# EAGLE schematic DME_Board_1 (EAGLE 7.2.0)
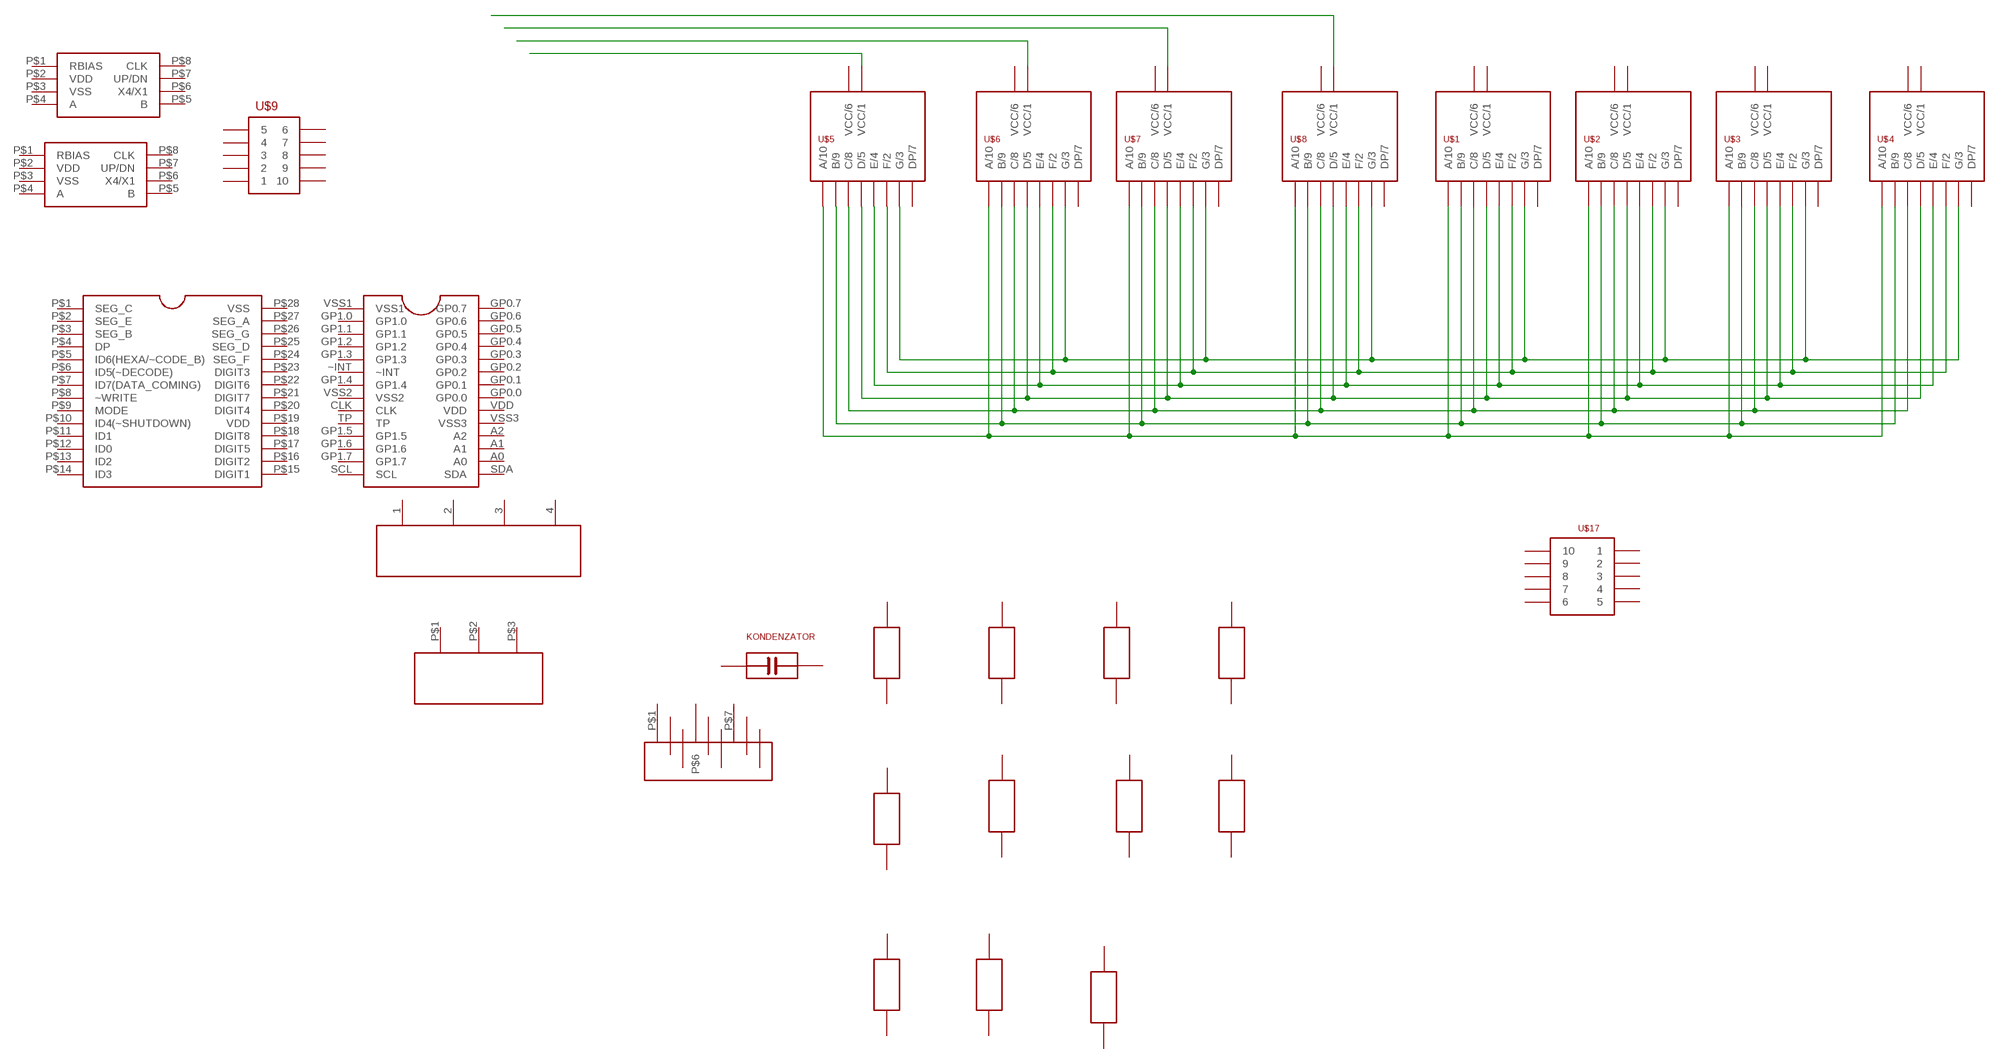
[diagram p0: schematic, sheet 1]

## Parts
U$1  SA3611EWA  [SA3611EWA]
U$2  SA3611EWA  [SA3611EWA]
U$3  SA3611EWA  [SA3611EWA]
U$4  SA3611EWA  [SA3611EWA]
U$5  SA3611EWA  [SA3611EWA]
U$6  SA3611EWA  [SA3611EWA]
U$7  SA3611EWA  [SA3611EWA]
U$8  SA3611EWA  [SA3611EWA]
U$9  ELMA_E37  [ELMA_E37]
U$10  46311LD  [46311LD]
U$11  REZISTOR  [REZISTOR]
U$12  T220  [T220]
U$13  REZISTOR  [REZISTOR]
U$14  ICM7228A  [ICM7228A]
U$15  REZISTOR  [REZISTOR]
U$16  MCP23016  [MCP23016]
U$17  LISTA_2X5  [LISTA_2X5]
U$19  REZISTOR  [REZISTOR]
U$21  LS7084  [LS7084]
U$22  LS7084  [LS7084]
U$23  KONDENZATOR  [KONDENZATOR]
U$24  ADRESA_0..2  [ADRESA_0..2]
U$25  REZISTOR  [REZISTOR]
U$26  REZISTOR  [REZISTOR]
U$27  REZISTOR  [REZISTOR]
U$28  REZISTOR  [REZISTOR]
U$29  REZISTOR  [REZISTOR]
U$30  REZISTOR  [REZISTOR]
U$31  REZISTOR  [REZISTOR]

## Nets
N$1: U$1.10(A/10) U$2.10(A/10) U$3.10(A/10) U$4.10(A/10) U$5.10(A/10) U$6.10(A/10) U$7.10(A/10) U$8.10(A/10)
N$2: U$1.9(B/9) U$2.9(B/9) U$3.9(B/9) U$4.9(B/9) U$5.9(B/9) U$6.9(B/9) U$7.9(B/9) U$8.9(B/9)
N$3: U$1.8(C/8) U$2.8(C/8) U$3.8(C/8) U$4.8(C/8) U$5.8(C/8) U$6.8(C/8) U$7.8(C/8) U$8.8(C/8)
N$4: U$1.5(D/5) U$2.5(D/5) U$3.5(D/5) U$4.5(D/5) U$5.5(D/5) U$6.5(D/5) U$7.5(D/5) U$8.5(D/5)
N$6: U$1.2(F/2) U$2.2(F/2) U$3.2(F/2) U$4.2(F/2) U$5.2(F/2) U$6.2(F/2) U$7.2(F/2) U$8.2(F/2)
N$7: U$1.3(G/3) U$2.3(G/3) U$3.3(G/3) U$4.3(G/3) U$5.3(G/3) U$6.3(G/3) U$7.3(G/3) U$8.3(G/3)
N$9: U$1.4(E/4) U$2.4(E/4) U$3.4(E/4) U$4.4(E/4) U$5.4(E/4) U$6.4(E/4) U$7.4(E/4) U$8.4(E/4)
N$16: U$5.1(VCC/1)
N$17: U$6.1(VCC/1)
N$18: U$7.1(VCC/1)
N$19: U$8.1(VCC/1)
Unconnected: U$1.1(VCC/1) U$1.6(VCC/6) U$1.7(DP/7) U$2.1(VCC/1) U$2.6(VCC/6) U$2.7(DP/7) U$3.1(VCC/1) U$3.6(VCC/6) U$3.7(DP/7) U$4.1(VCC/1) U$4.6(VCC/6) U$4.7(DP/7) U$5.6(VCC/6) U$5.7(DP/7) U$6.6(VCC/6) U$6.7(DP/7) U$7.6(VCC/6) U$7.7(DP/7) U$8.6(VCC/6) U$8.7(DP/7) U$9.1 U$9.2 U$9.3 U$9.4 U$9.5 U$9.6 U$9.7 U$9.8 U$9.9 U$9.10 U$10.1 U$10.2 U$10.3 U$10.4 U$11.P$1 U$11.P$2 U$12.P$1 U$12.P$2 U$12.P$3 U$13.P$1 U$13.P$2 U$14.P$1(SEG_C) U$14.P$2(SEG_E) U$14.P$3(SEG_B) U$14.P$4(DP) U$14.P$5(ID6(HEXA/~CODE_B)) U$14.P$6(ID5(~DECODE)) U$14.P$7(ID7(DATA_COMING)) U$14.P$8(~WRITE) U$14.P$9(MODE) U$14.P$10(ID4(~SHUTDOWN)) U$14.P$11(ID1) U$14.P$12(ID0) U$14.P$13(ID2) U$14.P$14(ID3) U$14.P$15(DIGIT1) U$14.P$16(DIGIT2) U$14.P$17(DIGIT5) U$14.P$18(DIGIT8) U$14.P$19(VDD) U$14.P$20(DIGIT4) U$14.P$21(DIGIT7) U$14.P$22(DIGIT6) U$14.P$23(DIGIT3) U$14.P$24(SEG_F) U$14.P$25(SEG_D) U$14.P$26(SEG_G) U$14.P$27(SEG_A) U$14.P$28(VSS) U$15.P$1 U$15.P$2 U$16.A0 U$16.A1 U$16.A2 U$16.CLK U$16.GP0.0 U$16.GP0.1 U$16.GP0.2 U$16.GP0.3 U$16.GP0.4 U$16.GP0.5 U$16.GP0.6 U$16.GP0.7 U$16.GP1.0 U$16.GP1.1 U$16.GP1.2 U$16.GP1.3 U$16.GP1.4 U$16.GP1.5 U$16.GP1.6 U$16.GP1.7 U$16.SCL U$16.SDA U$16.TP U$16.VDD U$16.VSS1 U$16.VSS2 U$16.VSS3 U$16.~INT U$17.1 U$17.2 U$17.3 U$17.4 U$17.5 U$17.6 U$17.7 U$17.8 U$17.9 U$17.10 U$19.P$1 U$19.P$2 U$21.P$1(RBIAS) U$21.P$2(VDD) U$21.P$3(VSS) U$21.P$4(A) U$21.P$5(B) U$21.P$6(X4/X1) U$21.P$7(UP/DN) U$21.P$8(CLK) U$22.P$1(RBIAS) U$22.P$2(VDD) U$22.P$3(VSS) U$22.P$4(A) U$22.P$5(B) U$22.P$6(X4/X1) U$22.P$7(UP/DN) U$22.P$8(CLK) U$23.P$1 U$23.P$2 U$24.P$1 U$24.P$2 U$24.P$3 U$24.P$4 U$24.P$5 U$24.P$6 U$24.P$7 U$24.P$8 U$24.P$9 U$25.P$1 U$25.P$2 U$26.P$1 U$26.P$2 U$27.P$1 U$27.P$2 U$28.P$1 U$28.P$2 U$29.P$1 U$29.P$2 U$30.P$1 U$30.P$2 U$31.P$1 U$31.P$2

## Library data of the parts
U$1-U$8 = RadioStack_v2:SA3611EWA
U$9 = RadioStack_v2:ELMA_E37
U$10 = RadioStack_v2:46311LD
U$11 U$13 U$15 U$19 U$25-U$31 = RadioStack_v2:REZISTOR
U$12 = RadioStack_v2:T220
U$14 = RadioStack_v2:ICM7228A
U$16 = RadioStack_v2:MCP23016
U$17 = RadioStack_v2:LISTA_2X5
U$21 U$22 = RadioStack_v2:LS7084
U$23 = RadioStack_v2:KONDENZATOR
U$24 = RadioStack_v2:ADRESA_0..2